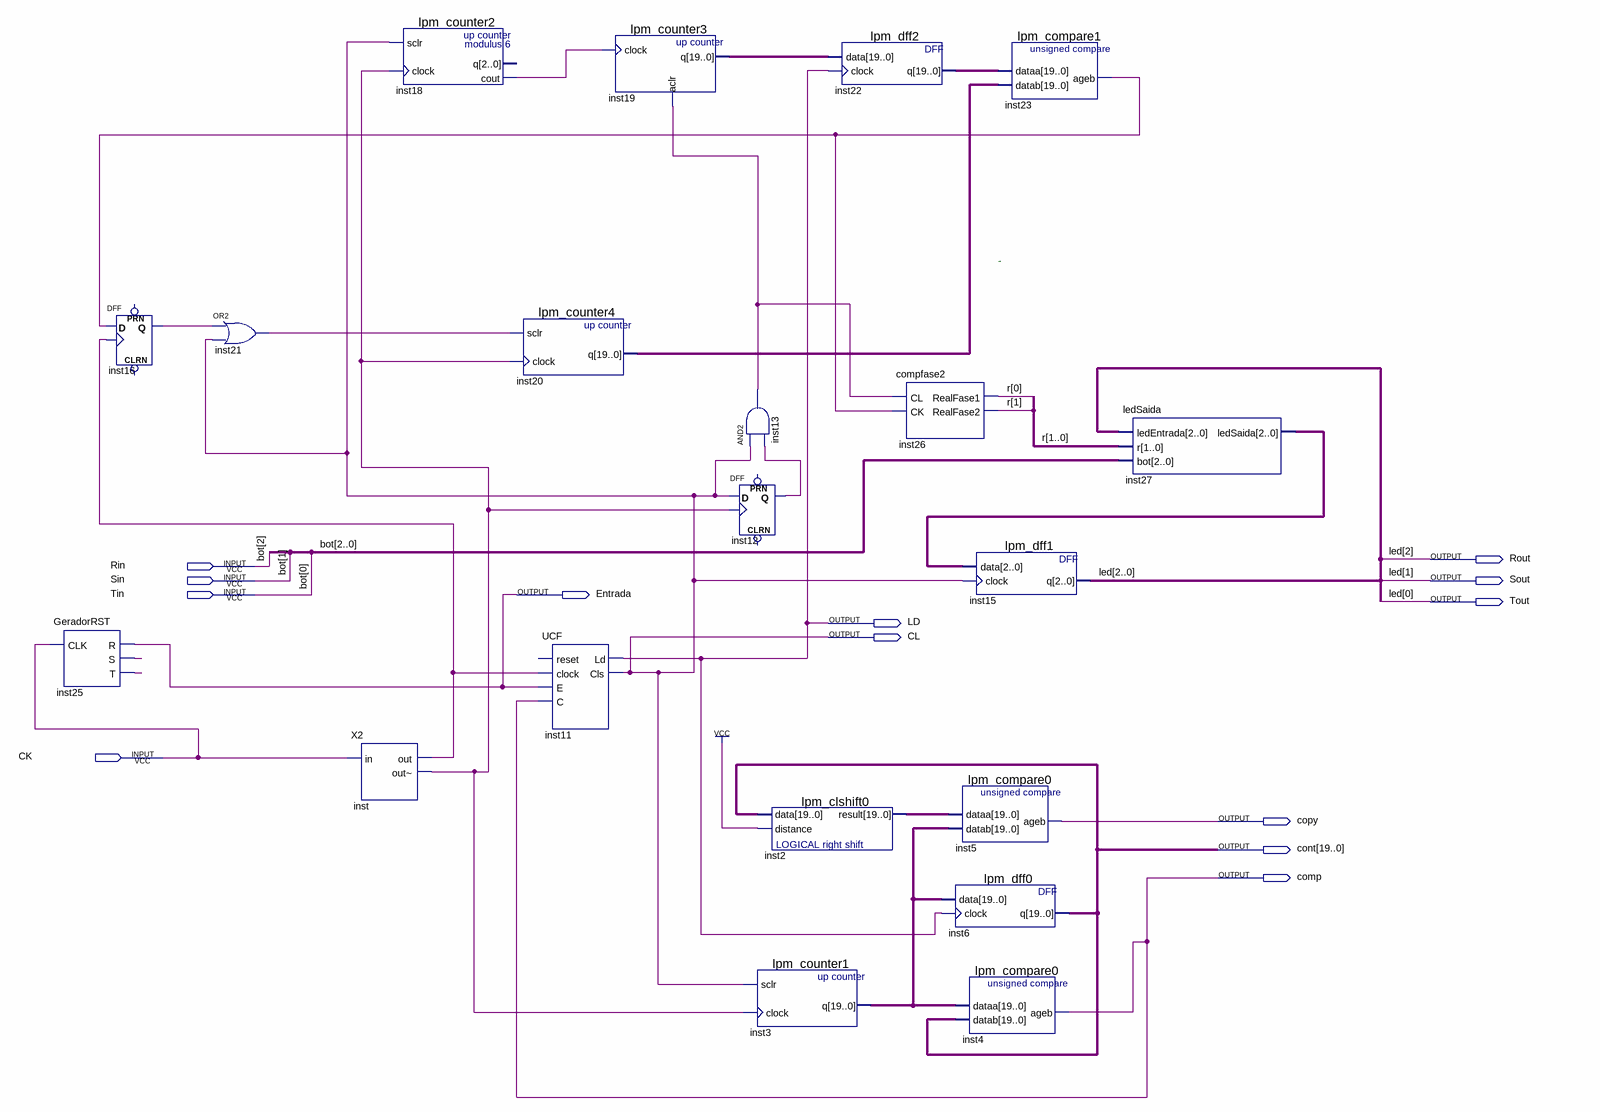
[diagram p0: schematic sheet]
// Quartus schematic Projeto_RST.bdf as structural Verilog: 20 symbols, 13 pins
module Projeto_RST (
  input  Rin,
  input  Sin,
  input  Tin,
  input  CK,
  output Rout,
  output Sout,
  output Entrada,
  output Tout,
  output LD,
  output CL,
  output copy,
  output [19:0] cont,
  output comp
);

  wire inst12_q, inst13_out, inst16_q, inst18_cout, inst21_out, inst23_ageb, inst25_s, inst25_t, inst_out,
       inst_out_;
  wire [1:0] r;
  wire [2:0] inst27_ledsaida;
  wire [19:0] inst2_result, inst3_q, inst19_q, inst20_q, inst22_q;

  GeradorRST inst25 (.CLK(CK), .R(Entrada), .S(inst25_s), .T(inst25_t));
  DFF inst16 (.CLK(inst_out), .D(inst23_ageb), .Q(inst16_q));  // open: CLRN, PRN
  or inst21 (inst21_out, inst16_q, CL);
  lpm_counter2 inst18 (.sclr(CL), .clock(inst_out_), .cout(inst18_cout));  // open: q
  X2 inst (.in(CK), .out(inst_out), .\out~ (inst_out_));
  lpm_counter4 inst20 (.sclr(inst21_out), .clock(inst_out_), .q(inst20_q));
  UCF inst11 (.clock(inst_out), .E(Entrada), .C(comp), .Ld(LD), .Cls(CL));  // open: reset
  lpm_counter3 inst19 (.clock(inst18_cout), .aclr(inst13_out), .q(inst19_q));
  and inst13 (inst13_out, CL, inst12_q);
  DFF inst12 (.CLK(inst_out_), .D(CL), .Q(inst12_q));  // open: CLRN, PRN
  lpm_clshift0 inst2 (.data(cont), .distance(1'b1), .result(inst2_result));
  lpm_counter1 inst3 (.sclr(CL), .clock(inst_out_), .q(inst3_q));
  lpm_dff2 inst22 (.data(inst19_q), .clock(LD), .q(inst22_q));
  compfase2 inst26 (.CL(inst13_out), .CK(inst23_ageb), .RealFase1(r[0]), .RealFase2(r[1]));
  lpm_dff1 inst15 (.data(inst27_ledsaida), .clock(CL), .q({Rout, Sout, Tout}));
  lpm_compare0 inst5 (.dataa(inst2_result), .datab(inst3_q), .ageb(copy));
  lpm_dff0 inst6 (.data(inst3_q), .clock(LD), .q(cont));
  lpm_compare0 inst4 (.dataa(inst3_q), .datab(cont), .ageb(comp));
  lpm_compare1 inst23 (.dataa(inst22_q), .datab(inst20_q), .ageb(inst23_ageb));
  ledSaida inst27 (.ledEntrada({Rout, Sout, Tout}), .r(r), .bot({Rin, Sin, Tin}), .ledSaida(inst27_ledsaida));

  // Other names for the same wires on the sheet: bot[2:0] = {Rin, Sin, Tin}; led[2:0] = {Rout, Sout, Tout}

  // Notes on the sheet:
  //   -
endmodule
